# Altium schematic sheet ADC-POWER SUPPLY.SchDoc: <SPECIFIC SHEET FUNCTION>
size A3; Date: DO NOT USE, RATHER USE PROJ OPTIONS; DrawnBy: DO NOT USE, RATHER USE PROJ OPTIONS; Engineer: DO NOT USE, RATHER USE PROJ OPTIONS; Organization: DO NOT USE, RATHER USE PROJ OPTIONS; DocumentNumber: 12; Revision: DO NOT USE, RATHER USE PROJ OPTIONS; SheetNumber: 12; SheetTotal: 12; SCH_Sheet_Filename: ADC-POWER SUPPLY.SchDoc; CurrentTime: DO NOT USE, RATHER USE PROJ OPTIONS; Time: DO NOT USE, RATHER USE PROJ OPTIONS; DocumentFullPathAndName: DO NOT USE, RATHER USE PROJ OPTIONS; DocumentName: DO NOT USE, RATHER USE PROJ OPTIONS; ModifiedDate: DO NOT USE, RATHER USE PROJ OPTIONS; ImagePath: DO NOT USE, RATHER USE PROJ OPTIONS
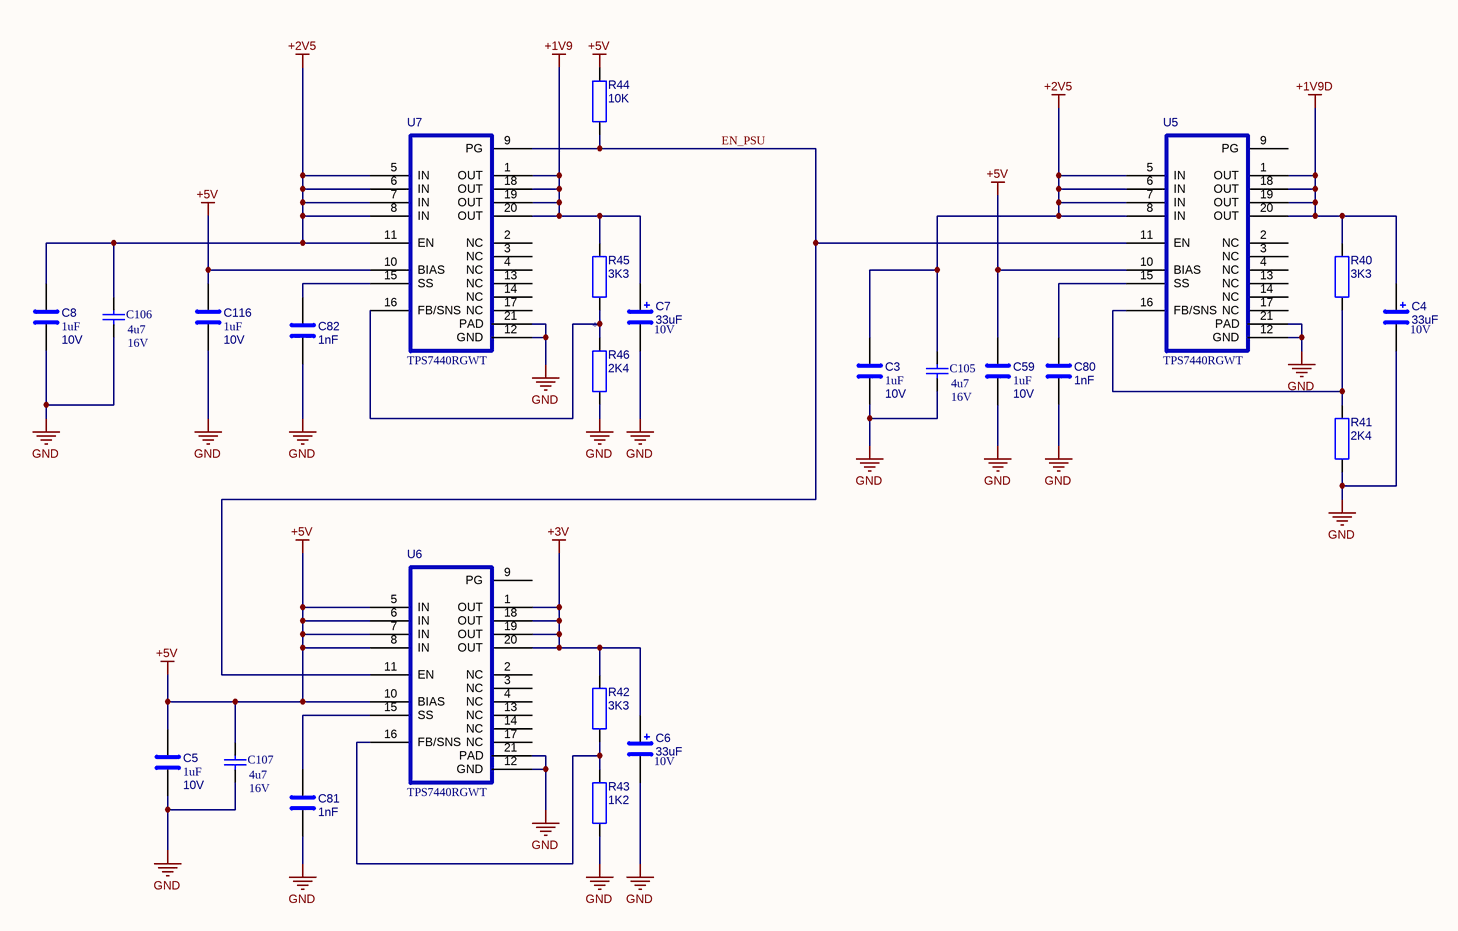
[diagram p0: ADC-POWER SUPPLY.SchDoc]

## Parts
C3  value 10V  Voltage: 1uF  [CAPC1632X80USR]  (hidden comment: Footprint ???)
C4  Voltage: 10V  [3528]  (hidden comment: 33uF)
C5  value 10V  Voltage: 1uF  [CAPC1632X80USR]  (hidden comment: Footprint ???)
C6  Voltage: 10V  [3528]  (hidden comment: 33uF)
C7  Voltage: 10V  [3528]  (hidden comment: 33uF)
C8  value 10V  Voltage: 1uF  [CAPC1632X80USR]  (hidden comment: Footprint ???)
C59  value 10V  Voltage: 1uF  [CAPC1632X80USR]  (hidden comment: Footprint ???)
C80  value 1nF  [0603]  (hidden comment: Footprint ???)
C81  value 1nF  [0603]  (hidden comment: Footprint ???)
C82  value 1nF  [0603]  (hidden comment: *)
C105  value 4u7  Voltage: 16V  [CAPC3225X220N]  (hidden comment: Capacitor 1210 SMD)
C106  value 4u7  Voltage: 16V  [CAPC3225X220N]  (hidden comment: Capacitor 1210 SMD)
C107  value 4u7  Voltage: 16V  [CAPC3225X220N]  (hidden comment: Capacitor 1210 SMD)
C116  value 10V  Voltage: 1uF  [CAPC1632X80USR]  (hidden comment: Footprint ???)
R40  3K3  [0603]
R41  2K4  [0603]
R42  3K3  [0603]
R43  1K2  [0603]
R44  10K  [0603]
R45  3K3  [0603]
R46  2K4  [0603]
U5  TPS7440RGWT  [QFN65P500X500X100-21AN]
U6  TPS7440RGWT  [QFN65P500X500X100-21AN]
U7  TPS7440RGWT  [QFN65P500X500X100-21AN]

## Nets
+1V9: C7.1 R45.1 U7.1(OUT) U7.18(OUT) U7.19(OUT) U7.20(OUT)
+1V9D: C4.1 R40.1 U5.1(OUT) U5.18(OUT) U5.19(OUT) U5.20(OUT)
+2V5: C3.1 C8.1 C105.2 C106.2 U5.5(IN) U5.6(IN) U5.7(IN) U5.8(IN) U7.5(IN) U7.6(IN) U7.7(IN) U7.8(IN) U7.11(EN)
+3V: C6.1 R42.1 U6.1(OUT) U6.18(OUT) U6.19(OUT) U6.20(OUT)
+5V: C5.1 C59.1 C107.2 C116.1 R44.1 U5.10(BIAS) U6.5(IN) U6.6(IN) U6.7(IN) U6.8(IN) U6.10(BIAS) U7.10(BIAS)
GND: C3.2 C4.2 C5.2 C6.2 C7.2 C8.2 C59.2 C80.2 C81.2 C82.2 C105.1 C106.1 C107.1 C116.2 R41.1 R43.1 R46.1 U5.12(GND) U5.21(PAD) U6.12(GND) U6.21(PAD) U7.12(GND) U7.21(PAD)
EN_PSU: R44.2 U5.11(EN) U6.11(EN) U7.9(PG)
NetC80_1: C80.1 U5.15(SS)
NetC81_1: C81.1 U6.15(SS)
NetC82_1: C82.1 U7.15(SS)
NetR40_2: R40.2 R41.2 U5.16(FB/SNS)
NetR42_2: R42.2 R43.2 U6.16(FB/SNS)
NetR45_2: R45.2 R46.2 U7.16(FB/SNS)

Not connected (* = marked no-connect by the designer): U5 2(NC) 3(NC) 4(NC) 9(PG) 13(NC) 14(NC) 17(NC); U6 2(NC) 3(NC) 4(NC) 9(PG) 13(NC) 14(NC) 17(NC); U7 2(NC) 3(NC) 4(NC) 13(NC) 14(NC) 17(NC)

## Notes on the sheet
- 2009   THIS DOCUMENT IS THE PROPERTY OF THE OWNER, AND MAY NOT BE COPIED OR USED FOR ANY PURPOSE OTHER THAN THAT FOR WHICH IT IS SUPPLIED WITHOUT PERMISSION IN WRITING FROM THE OWNER.
- C
- DATESTAMP OF THIS PRINT
- DRAWN BY:
- DOCUMENT NUMBER:
- SCHEMATIC FILENAME:
- PCB FILENAME:
- ENGINEER:
- APPROVED:
- CIRCUIT DIAGRAM
- DATE
- SHEET
- REVISION
- OF

## Library data of the parts
C3 C5 C8 C59 C80-C82 C116 = CAP-0603: CAP SMD 0603; Manufacturer: *; Manufacturer_PN: *; Created_By: *; Checked_By: *; Checked_Date: *; HelpURL: *; ComponentLink1Description: Footprint Detail; ComponentLink1URL: *; ComponentLink2Description: Application Note; ComponentLink2URL: *; ComponentLink3Description: Layout Guidelines; ComponentLink3URL: *; ComponentLink4Description: Technology Reference; ComponentLink4URL: *; Supplier1: *; Supplier2: *; Unit_Cost: *; MOQ: *; Leadtime: *; Inventory_Stock: *; Tolerance: *; Wattage: *; Package: 0603; ComponentLink5Description: Production Detail; ComponentLink5URL: *; Note: *; Stock Code: *
  C80-C82: Voltage: *
C4 C6 C7 = CAPACITOR-POLARISED: Created_By: EDA-ASA; Checked_By: *; Checked_Date: *; HelpURL: *; ComponentLinked1Description: *; ComponentLinked1URL: *; ComponentLinked2Description: *; ComponentLinked2URL: *; ComponentLinked3Description: *; ComponentLinked3URL: *; ComponentLinked4Description: *; ComponentLinked4URL: *; Supplier1: *; Supplier2: *; Unit_Cost: *; MOQ: *; Leadtime: *; Inventory_Stock: *; Tolerance: *; Wattage: *; Value: 33uF
C105-C107 = cap1210: Created_By: EDA-ASA; Checked_By: *; Checked_Date: *; HelpURL: *; Supplier1: *; Supplier2: *; Unit_Cost: *; MOQ: *; Leadtime: *; Inventory_Stock: *; Tolerance: *; Wattage: *; Package: 1210; ComponentLinked1Description: *; ComponentLinked1URL: *; ComponentLinked2Description: *; ComponentLinked2URL: *; ComponentLinked3Description: *; ComponentLinked3URL: *; ComponentLinked4Description: *; ComponentLinked4URL: *
R40-R46 = RES-0805: RESISTOR SMD 0805; Checked_By: NN; Manufacturer: *; Manufacturer_PN: *; Created_By: *; Checked_Date: 5-08-2009; HelpURL: *; ComponentLink1Description: Footprint Detail; ComponentLink1URL: *; ComponentLink2Description: Application Note; ComponentLink2URL: *; ComponentLink3Description: Layout Guidelines; ComponentLink3URL: *; ComponentLink4Description: Technology Reference; ComponentLink4URL: *; Supplier1: *; Supplier2: *; Unit_Cost: *; MOQ: *; Leadtime: *; Inventory_Stock: *; Tolerance: *; Wattage: *; Voltage: *; Package: 0805; ComponentLink5Description: Production Detail; ComponentLink5URL: *; Note: *; Stock Code: *
  R40 R42 R45: Value: 3K3
  R41 R46: Value: 2K4
  R43: Value: 1K2
  R44: Value: 10K
U5-U7 = TPS74401RGWT: 3.0A Ultra-LDO with Programmable Soft-Start; Manufacturer: TI; Created_By: IN; Manufacturer_PN: TPS7440RGWT; Checked_By: *; Checked_Date: *; HelpURL: X:\Datasheets\By Manufacturer\TI\tps74401.pdf; ComponentLink1Description: Footprint Detail; ComponentLink1URL: X:\Datasheets\By Manufacturer\TI\tps74401.pdf#page=12; ComponentLink2Description: Application Note; ComponentLink2URL: X:\Datasheets\By Manufacturer\TI\tps74401.pdf#page=13; ComponentLink3Description: Layout Guidelines; ComponentLink3URL: X:\Datasheets\By Manufacturer\TI\tps74401.pdf#page=14; ComponentLink4Description: Technology Reference; ComponentLink4URL: X:\Datasheets\By Manufacturer\TI\tps74401.pdf#page=15; Supplier1: *; Supplier2: *; Unit_Cost: *; MOQ: *; Leadtime: *; Inventory_Stock: *; Tolerance: *; Wattage: *; Voltage: *; Package: *; ComponentLink5Description: Production Detail; ComponentLink5URL: *; Note: *; Stock Code: *